# Altium project DuAn_HMI_F7.PrjPcb
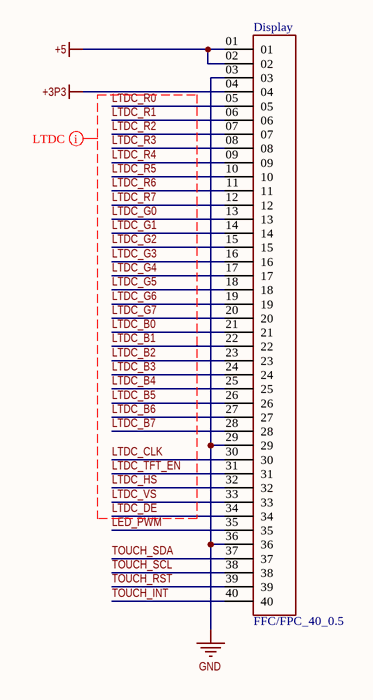
[diagram p0: LCD_TFT_Module.SchDoc]
6 sheets, 107 parts. Net scope: global (net labels, ports and power ports of the same name join across sheets).
Board file: HMI_F7_V3.PcbDoc
Sheets:
  LCD_TFT_Module.SchDoc
  LCD_TFT.SchDoc
  SDRAM.SchDoc
  RS232.SchDoc
  MCU.SchDoc
  POWERDoc.SchDoc

## Sheet LCD_TFT_Module.SchDoc
size A; SheetNumber: 1; SheetTotal: 6

### Parts
Display  FFC/FPC_40_0.5  [FFC_40_0.5mm]

### Nets
+3P3: Display.04
+5: Display.01 Display.02
GND: Display.03 Display.29 Display.36
LED_PWM: Display.35
LTDC_B0: Display.21
LTDC_B1: Display.22
LTDC_B2: Display.23
LTDC_B3: Display.24
LTDC_B4: Display.25
LTDC_B5: Display.26
LTDC_B6: Display.27
LTDC_B7: Display.28
LTDC_CLK: Display.30
LTDC_DE: Display.34
LTDC_G0: Display.13
LTDC_G1: Display.14
LTDC_G2: Display.15
LTDC_G3: Display.16
LTDC_G4: Display.17
LTDC_G5: Display.18
LTDC_G6: Display.19
LTDC_G7: Display.20
LTDC_HS: Display.32
LTDC_R0: Display.05
LTDC_R1: Display.06
LTDC_R2: Display.07
LTDC_R3: Display.08
LTDC_R4: Display.09
LTDC_R5: Display.10
LTDC_R6: Display.11
LTDC_R7: Display.12
LTDC_TFT_EN: Display.31
LTDC_VS: Display.33
TOUCH_INT: Display.40
TOUCH_RST: Display.39
TOUCH_SCL: Display.38
TOUCH_SDA: Display.37

### Layout directives
net class LTDC: LTDC_B0, LTDC_B1, LTDC_B2, LTDC_B3, LTDC_B4, LTDC_B5, LTDC_B6, LTDC_B7, LTDC_CLK, LTDC_DE, LTDC_G0, LTDC_G1, LTDC_G2, LTDC_G3, LTDC_G4, LTDC_G5, LTDC_G6, LTDC_G7, LTDC_HS, LTDC_R0, LTDC_R1, LTDC_R2, LTDC_R3, LTDC_R4, LTDC_R5, LTDC_R6, LTDC_R7, LTDC_TFT_EN, LTDC_VS

### Library data of the parts
Display = FFC/FPC_40_0.5: MF: Samtec; MP: ZF5S-40-02-T-WT; Package: None; Availability: Unavailable; Value: *; Price: None

## Sheet LCD_TFT.SchDoc
size A; SheetNumber: 2; SheetTotal: 5
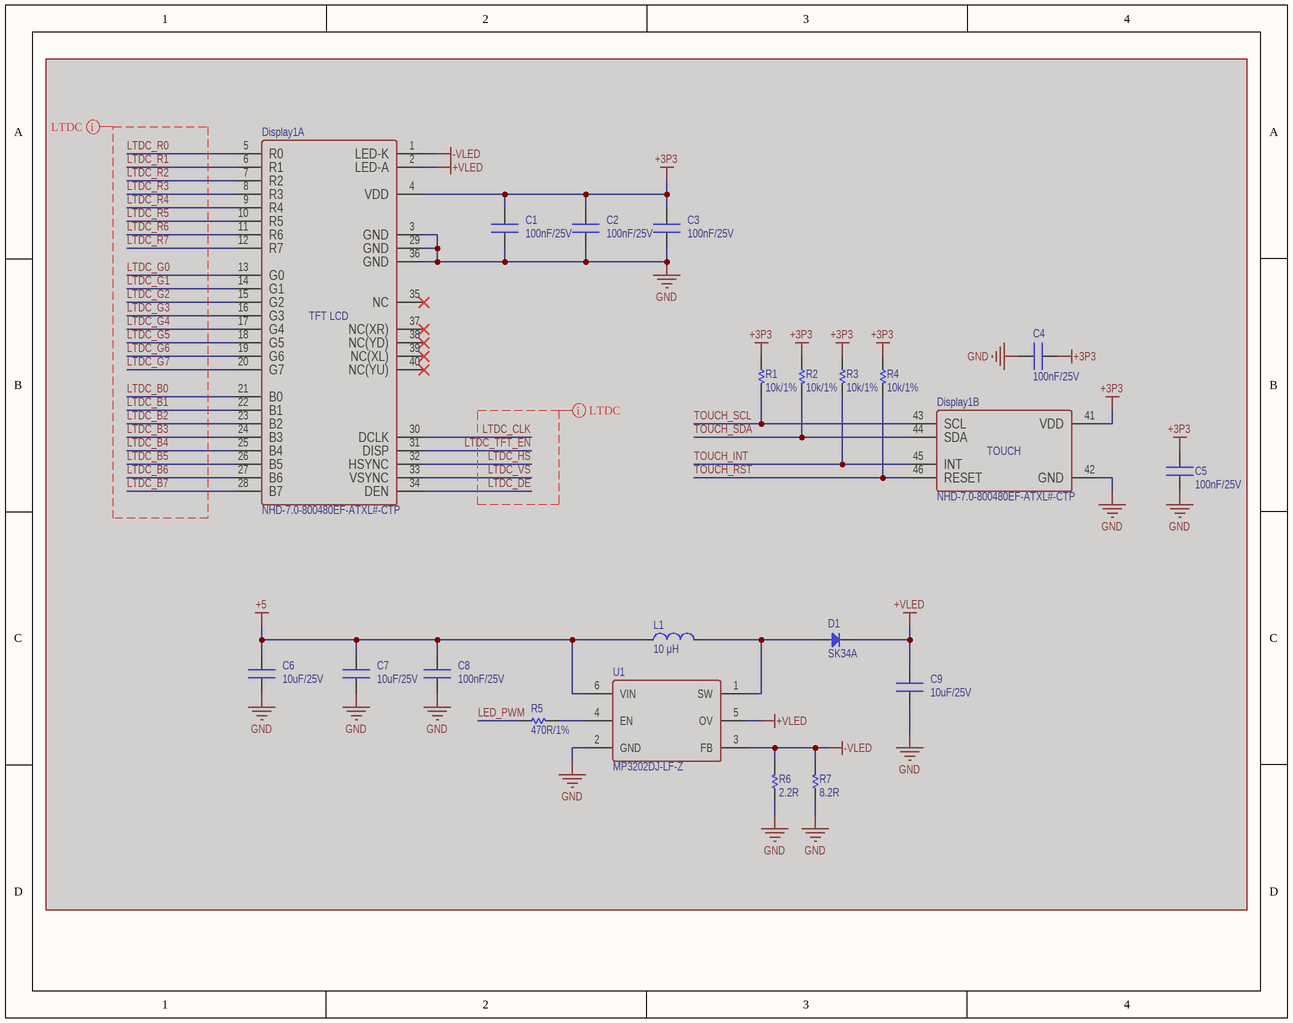
[diagram p1: LCD_TFT.SchDoc]

### Parts
C1  100nF/25V  [CN-SMD-0603]  (masked out: inside a compile mask, not in the netlist)
C2  100nF/25V  [CN-SMD-0603]  (masked out: inside a compile mask, not in the netlist)
C3  100nF/25V  [CN-SMD-0603]  (masked out: inside a compile mask, not in the netlist)
C4  100nF/25V  [CN-SMD-0603]  (masked out: inside a compile mask, not in the netlist)
C5  100nF/25V  [CN-SMD-0603]  (masked out: inside a compile mask, not in the netlist)
C6  10uF/25V  [CN-SMD-0603]  (masked out: inside a compile mask, not in the netlist)
C7  10uF/25V  [CN-SMD-0603]  (masked out: inside a compile mask, not in the netlist)
C8  100nF/25V  [CN-SMD-0603]  (masked out: inside a compile mask, not in the netlist)
C9  10uF/25V  [CN-SMD-0603]  (masked out: inside a compile mask, not in the netlist)
D1  SK34A  [DIO-SMD-A]  (masked out: inside a compile mask, not in the netlist)
Display1  NHD-7.0-800480EF-ATXL#-CTP  [NHD-7.0-800480EF-ATXL#-CTP]  (parts A,B of 2)  (masked out: inside a compile mask, not in the netlist)
L1  10 μH  [L-SMD-M-5x5]  (masked out: inside a compile mask, not in the netlist)
R1  10k/1%  [RES-SMD-0603]  (masked out: inside a compile mask, not in the netlist)
R2  10k/1%  [RES-SMD-0603]  (masked out: inside a compile mask, not in the netlist)
R3  10k/1%  [RES-SMD-0603]  (masked out: inside a compile mask, not in the netlist)
R4  10k/1%  [RES-SMD-0603]  (masked out: inside a compile mask, not in the netlist)
R5  470R/1%  [RES-SMD-0603]  (masked out: inside a compile mask, not in the netlist)
R6  2.2R  [RES-SMD-0805]  (masked out: inside a compile mask, not in the netlist)
R7  8.2R  [RES-SMD-0805]  (masked out: inside a compile mask, not in the netlist)
U1  MP3202DJ-LF-Z  [SOT23-6]  (masked out: inside a compile mask, not in the netlist)

### Layout directives
net class LTDC: LTDC_B0, LTDC_B1, LTDC_B2, LTDC_B3, LTDC_B4, LTDC_B5, LTDC_B6, LTDC_B7, LTDC_CLK, LTDC_DE, LTDC_G0, LTDC_G1, LTDC_G2, LTDC_G3, LTDC_G4, LTDC_G5, LTDC_G6, LTDC_G7, LTDC_HS, LTDC_R0, LTDC_R1, LTDC_R2, LTDC_R3, LTDC_R4, LTDC_R5, LTDC_R6, LTDC_R7, LTDC_TFT_EN, LTDC_VS

### Notes on the sheet
- (in symbol NHD-7.0-800480EF-ATXL#-CTP, part A) TFT LCD
- (in symbol NHD-7.0-800480EF-ATXL#-CTP, part B) TOUCH

### Library data of the parts
C1-C5 C8 = CN: CAP CER 0.1UF 25V X7R 0603; PN: CL10B104KA8NNNC
  C1: ComponentLink1Description: PN; ComponentLink1URL: CL10B104KA8NNNC
C6 C7 C9 = CN: CAP CER 10UF 25V X5R 0603; PN: CL10A106MA8NRNC
D1 = Diode SMD: DIODE SCHOTTKY 40V 3A DO214AC; Code - JEDEC: DO-214-AB; Published: 8-Jun-2000; Revision: July-2002: Re-released for DXP Platform.; Publisher: Altium Limited; PN: SK34A
Display1 = NHD-7.0-800480EF-ATXL#-CTP: TFT (Thin-Film-Transistor) Color Liquid Crystal Display Module, 0541044031 + 52271-0679; PN: NHD-7.0-800480EF-ATXL#-CTP
L1 = L-SMD-1: FIXED IND 10UH 1.2A 125 MOHM SMD; Manufacturer: Wurth Elektronik; PN: NRS5024T100MMGJ; Inductance: 10 μH; ComponentLink1Description: Manufacturer; ComponentLink1URL: http://www.we-online.de; Created by: Baojun Chen; Created Date: Nov.2015; ComponentLink2Description: Datasheet; ComponentLink2URL: http://katalog.we-online.de/pbs/datasheet/78477010.pdf
R1-R4 = Res-SMD: RES SMD 10K OHM 1% 1/10W 0603; Manufacturer: Generic Components; Class: Passive; PN: ERJ-3EKF1002V; Published: 08/06/2000; Publisher: Altium Hobart Technology Centre
R5 = Res-SMD: RES 470 OHM 1% 1/10W 0603; Manufacturer: Generic Components; PN: RC0603FR-07470RL; Published: 08/06/2000; Publisher: Altium Hobart Technology Centre
R6 = Res-SMD: RES 2.2 OHM 5% 1/8W 0805; Manufacturer: Generic Components; PN: RMCF0805JT2R20; Class: Passive; Publisher: Altium Hobart Technology Centre
R7 = Res-SMD: RES 8.2 OHM 1% 1/8W 0805; Manufacturer: Generic Components; PN: RMCF0805FT8R20; Class: Passive; Publisher: Altium Hobart Technology Centre
U1 = MP3202: IC LED DRVR RGLTR PWM TSOT23-6; PN: MP3202DJ-LF-Z

## Sheet SDRAM.SchDoc
size A; SheetNumber: 2; SheetTotal: 5
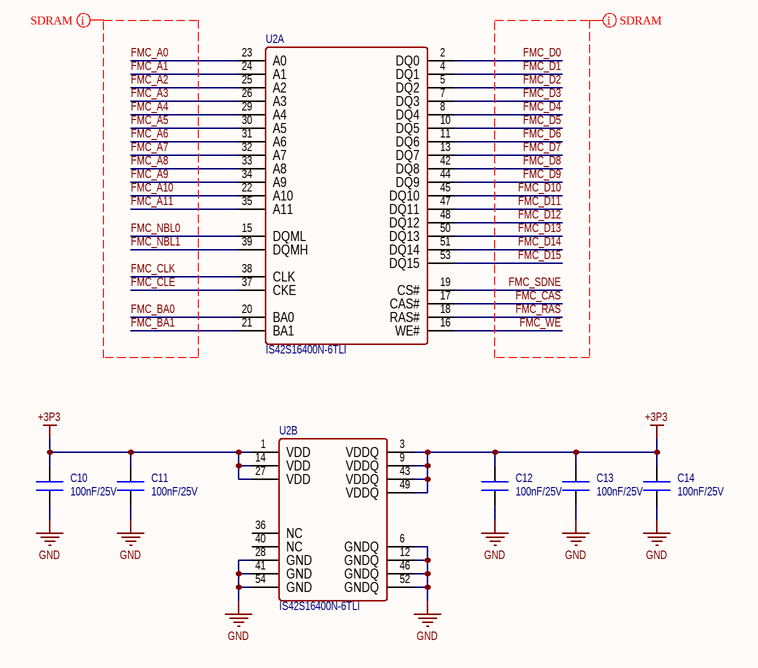
[diagram p2: SDRAM.SchDoc]

### Parts
C10  100nF/25V  [CN-SMD-0603]
C11  100nF/25V  [CN-SMD-0603]
C12  100nF/25V  [CN-SMD-0603]
C13  100nF/25V  [CN-SMD-0603]
C14  100nF/25V  [CN-SMD-0603]
U2  IS42S16400N-6TLI  [TSOP80P1180X100-54N]  (parts A,B of 2)

### Nets
+3P3: C10.2 C11.2 C12.2 C13.2 C14.2 U2.1(VDD) U2.3(VDDQ) U2.9(VDDQ) U2.14(VDD) U2.27(VDD) U2.43(VDDQ) U2.49(VDDQ)
GND: C10.1 C11.1 C12.1 C13.1 C14.1 U2.6(GNDQ) U2.12(GNDQ) U2.28(GND) U2.41(GND) U2.46(GNDQ) U2.52(GNDQ) U2.54(GND)
FMC_A0: U2.23(A0)
FMC_A1: U2.24(A1)
FMC_A2: U2.25(A2)
FMC_A3: U2.26(A3)
FMC_A4: U2.29(A4)
FMC_A5: U2.30(A5)
FMC_A6: U2.31(A6)
FMC_A7: U2.32(A7)
FMC_A8: U2.33(A8)
FMC_A9: U2.34(A9)
FMC_A10: U2.22(A10)
FMC_A11: U2.35(A11)
FMC_BA0: U2.20(BA0)
FMC_BA1: U2.21(BA1)
FMC_CAS: U2.17(CAS#)
FMC_CLE: U2.37(CKE)
FMC_CLK: U2.38(CLK)
FMC_D0: U2.2(DQ0)
FMC_D1: U2.4(DQ1)
FMC_D2: U2.5(DQ2)
FMC_D3: U2.7(DQ3)
FMC_D4: U2.8(DQ4)
FMC_D5: U2.10(DQ5)
FMC_D6: U2.11(DQ6)
FMC_D7: U2.13(DQ7)
FMC_D8: U2.42(DQ8)
FMC_D9: U2.44(DQ9)
FMC_D10: U2.45(DQ10)
FMC_D11: U2.47(DQ11)
FMC_D12: U2.48(DQ12)
FMC_D13: U2.50(DQ13)
FMC_D14: U2.51(DQ14)
FMC_D15: U2.53(DQ15)
FMC_NBL0: U2.15(DQML)
FMC_NBL1: U2.39(DQMH)
FMC_RAS: U2.18(RAS#)
FMC_SDNE: U2.19(CS#)
FMC_WE: U2.16(WE#)

Not connected (* = marked no-connect by the designer): U2 36(NC) 40(NC)

### Layout directives
net class SDRAM: FMC_A0, FMC_A1, FMC_A2, FMC_A3, FMC_A4, FMC_A5, FMC_A6, FMC_A7, FMC_A8, FMC_A9, FMC_A10, FMC_A11, FMC_BA0, FMC_BA1, FMC_CAS, FMC_CLE, FMC_CLK, FMC_D0, FMC_D1, FMC_D2, FMC_D3, FMC_D4, FMC_D5, FMC_D6, FMC_D7, FMC_D8, FMC_D9, FMC_D10, FMC_D11, FMC_D12, FMC_D13, FMC_D14, FMC_D15, FMC_NBL0, FMC_NBL1, FMC_RAS, FMC_SDNE, FMC_WE

### Library data of the parts
C10-C14 = CN: as C1 on sheet LCD_TFT
U2 = IS42S16400N-6TLI: 1 Meg Bits x 16 Bits x 4 Banks (64-MBIT) SYNCHRONOUS DYNAMIC RAM; PN: IS42S16400N-6TLI

## Sheet RS232.SchDoc
size A; SheetNumber: 3; SheetTotal: 5
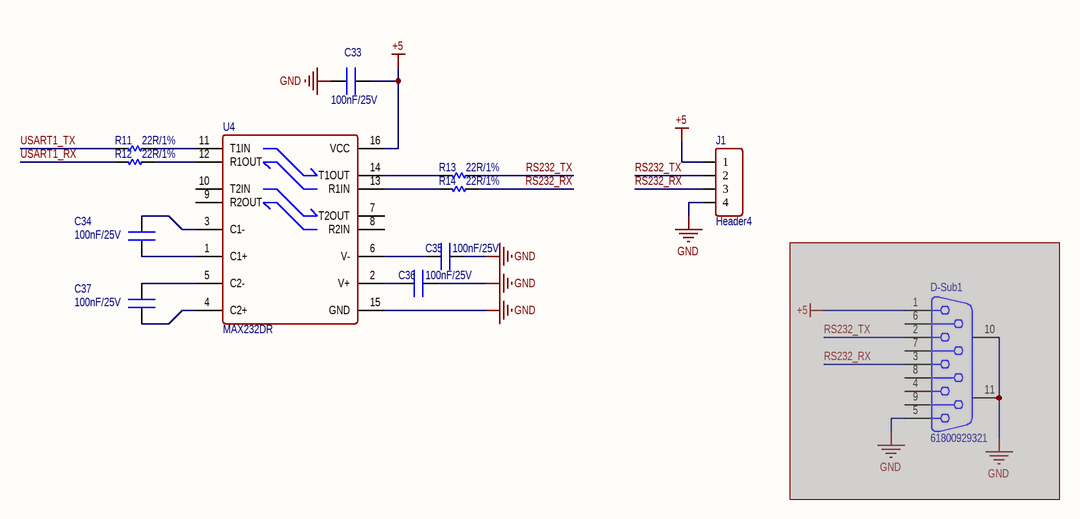
[diagram p3: RS232.SchDoc]

### Parts
C33  100nF/25V  [CN-SMD-0603]
C34  100nF/25V  [CN-SMD-0603]
C35  100nF/25V  [CN-SMD-0603]
C36  100nF/25V  [CN-SMD-0603]
C37  100nF/25V  [CN-SMD-0603]
D-Sub1  61800929321  [COM9SMDB]  (masked out: inside a compile mask, not in the netlist)
J1  Header4  [XH2.54-4-SMD]
R11  22R/1%  [RES-SMD-0603]
R12  22R/1%  [RES-SMD-0603]
R13  22R/1%  [RES-SMD-0603]
R14  22R/1%  [RES-SMD-0603]
U4  MAX232DR  [SO16]

### Nets
+5: C33.1 J1.1 U4.16(VCC)
GND: C33.2 C35.1 C36.1 J1.4 U4.15(GND)
RS232_RX: J1.3 R14.1
RS232_TX: J1.2 R13.1
USART1_RX: R12.2
USART1_TX: R11.2
NetC34_1: C34.1 U4.1(C1+)
NetC34_2: C34.2 U4.3(C1-)
NetC35_2: C35.2 U4.6(V-)
NetC36_2: C36.2 U4.2(V+)
NetC37_1: C37.1 U4.4(C2+)
NetC37_2: C37.2 U4.5(C2-)
NetR11_1: R11.1 U4.11(T1IN)
NetR12_1: R12.1 U4.12(R1OUT)
NetR13_2: R13.2 U4.14(T1OUT)
NetR14_2: R14.2 U4.13(R1IN)

Not connected (* = marked no-connect by the designer): U4 7(T2OUT) 8(R2IN) 9(R2OUT) 10(T2IN)

### Library data of the parts
C33-C37 = CN: as C1 on sheet LCD_TFT
D-Sub1 = CON 9BD: Manufacturer: Würth Elektronik eiSos GmbH; PN: 61800929321; ComponentLink1Description: Manufacturer; ComponentLink1URL: http://www.we-online.de; Created by: Christin Zierenner; Created Date: May 2012; ComponentLink2Description: Datasheet; ComponentLink2URL: http://katalog.we-online.de/kataloge/eisos/index.php?language=en&pf=Filter_gerade
J1 = Header4: Connector 4; Manufacturer: W¨¹rth Elektronik eiSos GmbH; partNo: 613002143121; ComponentLink1 Description: Manufacturer; ComponentLink2 Description: Datasheet; NoPins: 02; Created Date: 29 March 2013; ComponentLink1URL: http://www.we-online.com; ComponentLink2URL: http://katalog.we-online.de/em/datasheet/6130xx143121.pdf; Created by: Karrer Zheng
R11-R14 = Res-SMD: RES SMD 22 OHM 1% 1/10W 0603; PN: ERJ-3EKF22R0V
U4 = MAX3232: IC TRANSCEIVER FULL 2/2 16SOIC; PN: MAX232DR

## Sheet MCU.SchDoc
size C; SheetNumber: 5; SheetTotal: 6
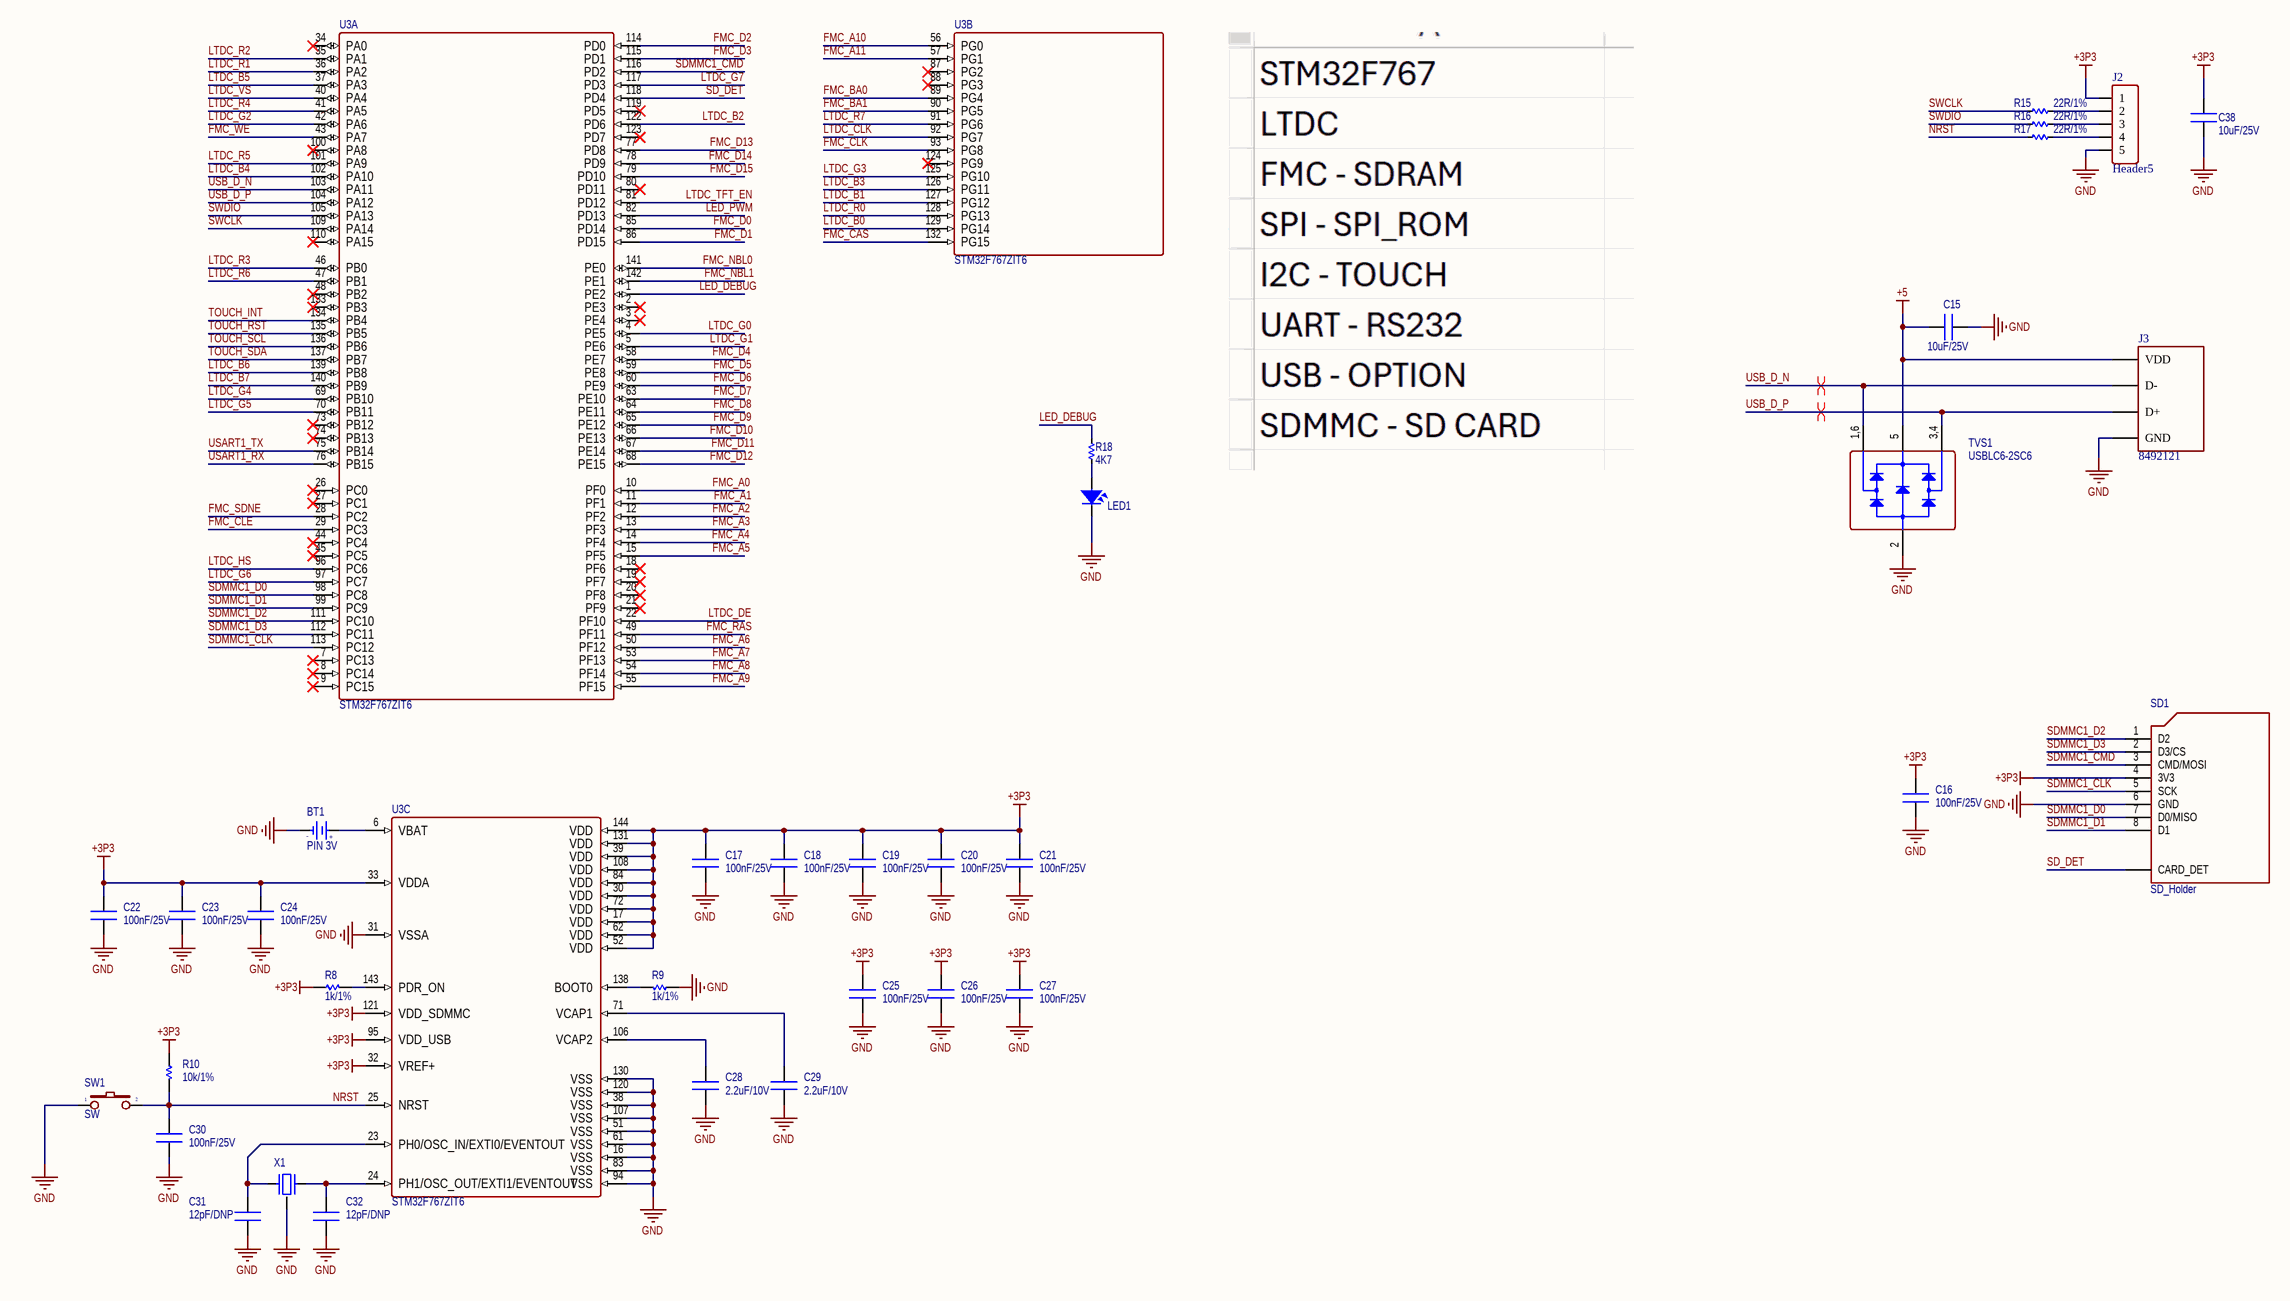
[diagram p4: MCU.SchDoc]

### Parts
BT1  PIN 3V  [BAT_3035]
C15  10uF/25V  [CN-SMD-0603]
C16  100nF/25V  [CN-SMD-0603]
C17  100nF/25V  [CN-SMD-0603]
C18  100nF/25V  [CN-SMD-0603]
C19  100nF/25V  [CN-SMD-0603]
C20  100nF/25V  [CN-SMD-0603]
C21  100nF/25V  [CN-SMD-0603]
C22  100nF/25V  [CN-SMD-0603]
C23  100nF/25V  [CN-SMD-0603]
C24  100nF/25V  [CN-SMD-0603]
C25  100nF/25V  [CN-SMD-0603]
C26  100nF/25V  [CN-SMD-0603]
C27  100nF/25V  [CN-SMD-0603]
C28  2.2uF/10V  [CN-SMD-0603]
C29  2.2uF/10V  [CN-SMD-0603]
C30  100nF/25V  [CN-SMD-0603]
C31  12pF/DNP  [CN-SMD-0603]
C32  12pF/DNP  [CN-SMD-0603]
C38  10uF/25V  [CN-SMD-0603]
J2  Header5  [XH2.54-5-SMD]
J3  8492121  [USB-C4]
LED1  LED  [LED-0603-RED]  (value not drawn)
R8  1k/1%  [RES-SMD-0603]
R9  1k/1%  [RES-SMD-0603]
R10  10k/1%  [RES-SMD-0603]
R15  22R/1%  [RES-SMD-0603]
R16  22R/1%  [RES-SMD-0603]
R17  22R/1%  [RES-SMD-0603]
R18  4K7  [RES-SMD-0603]
SD1  SD_Holder  [SD Socket]
SW1  SW  [SW1-SMD]
TVS1  USBLC6-2SC6  [SOT23-6]
U3  STM32F767ZIT6  [LQFP144]  (parts A,B,C of 3)
X1  XTAL 25MHz  [XT4-16.000MHz-4_V]  (value not drawn)

### Nets
+3P3: C16.2 C17.2 C18.2 C19.2 C20.2 C21.2 C22.2 C23.2 C24.2 C25.2 C26.2 C27.2 C38.1 J2.1 R8.2 R10.2 SD1.4(3V3) U3.17(VDD) U3.30(VDD) U3.32(VREF+) U3.33(VDDA) U3.39(VDD) U3.52(VDD) U3.62(VDD) U3.72(VDD) U3.84(VDD) U3.95(VDD_USB) U3.108(VDD) U3.121(VDD_SDMMC) U3.131(VDD) U3.144(VDD)
+5: C15.2 J3.1(VDD) TVS1.5
GND: BT1.2(GND) C15.1 C16.1 C17.1 C18.1 C19.1 C20.1 C21.1 C22.1 C23.1 C24.1 C25.1 C26.1 C27.1 C28.2 C29.2 C30.2 C31.1 C32.1 C38.2 J2.5 J3.4(GND) LED1.2 R9.2 SD1.6(GND) SW1.1 TVS1.2 U3.16(VSS) U3.31(VSSA) U3.38(VSS) U3.51(VSS) U3.61(VSS) U3.83(VSS) U3.94(VSS) U3.107(VSS) U3.120(VSS) U3.130(VSS) X1.2,4(GND)
FMC_A0: U3.10(PF0)
FMC_A1: U3.11(PF1)
FMC_A2: U3.12(PF2)
FMC_A3: U3.13(PF3)
FMC_A4: U3.14(PF4)
FMC_A5: U3.15(PF5)
FMC_A6: U3.50(PF12)
FMC_A7: U3.53(PF13)
FMC_A8: U3.54(PF14)
FMC_A9: U3.55(PF15)
FMC_A10: U3.56(PG0)
FMC_A11: U3.57(PG1)
FMC_BA0: U3.89(PG4)
FMC_BA1: U3.90(PG5)
FMC_CAS: U3.132(PG15)
FMC_CLE: U3.29(PC3)
FMC_CLK: U3.93(PG8)
FMC_D0: U3.85(PD14)
FMC_D1: U3.86(PD15)
FMC_D2: U3.114(PD0)
FMC_D3: U3.115(PD1)
FMC_D4: U3.58(PE7)
FMC_D5: U3.59(PE8)
FMC_D6: U3.60(PE9)
FMC_D7: U3.63(PE10)
FMC_D8: U3.64(PE11)
FMC_D9: U3.65(PE12)
FMC_D10: U3.66(PE13)
FMC_D11: U3.67(PE14)
FMC_D12: U3.68(PE15)
FMC_D13: U3.77(PD8)
FMC_D14: U3.78(PD9)
FMC_D15: U3.79(PD10)
FMC_NBL0: U3.141(PE0)
FMC_NBL1: U3.142(PE1)
FMC_RAS: U3.49(PF11)
FMC_SDNE: U3.28(PC2)
FMC_WE: U3.43(PA7)
LED_DEBUG: R18.1 U3.1(PE2)
LED_PWM: U3.82(PD13)
LTDC_B0: U3.129(PG14)
LTDC_B1: U3.127(PG12)
LTDC_B2: U3.122(PD6)
LTDC_B3: U3.126(PG11)
LTDC_B4: U3.102(PA10)
LTDC_B5: U3.37(PA3)
LTDC_B6: U3.139(PB8)
LTDC_B7: U3.140(PB9)
LTDC_CLK: U3.92(PG7)
LTDC_DE: U3.22(PF10)
LTDC_G0: U3.4(PE5)
LTDC_G1: U3.5(PE6)
LTDC_G2: U3.42(PA6)
LTDC_G3: U3.125(PG10)
LTDC_G4: U3.69(PB10)
LTDC_G5: U3.70(PB11)
LTDC_G6: U3.97(PC7)
LTDC_G7: U3.117(PD3)
LTDC_HS: U3.96(PC6)
LTDC_R0: U3.128(PG13)
LTDC_R1: U3.36(PA2)
LTDC_R2: U3.35(PA1)
LTDC_R3: U3.46(PB0)
LTDC_R4: U3.41(PA5)
LTDC_R5: U3.101(PA9)
LTDC_R6: U3.47(PB1)
LTDC_R7: U3.91(PG6)
LTDC_TFT_EN: U3.81(PD12)
LTDC_VS: U3.40(PA4)
NRST: C30.1 R10.1 R17.2 SW1.2 U3.25(NRST)
SD_DET: SD1.9(CARD_DET) U3.118(PD4)
SDMMC1_CLK: SD1.5(SCK) U3.113(PC12)
SDMMC1_CMD: SD1.3(CMD/MOSI) U3.116(PD2)
SDMMC1_D0: SD1.7(D0/MISO) U3.98(PC8)
SDMMC1_D1: SD1.8(D1) U3.99(PC9)
SDMMC1_D2: SD1.1(D2) U3.111(PC10)
SDMMC1_D3: SD1.2(D3/CS) U3.112(PC11)
SWCLK: R15.2 U3.109(PA14)
SWDIO: R16.2 U3.105(PA13)
TOUCH_INT: U3.134(PB4)
TOUCH_RST: U3.135(PB5)
TOUCH_SCL: U3.136(PB6)
TOUCH_SDA: U3.137(PB7)
USART1_RX: U3.76(PB15)
USART1_TX: U3.75(PB14)
USB_D_N: J3.2(D-) TVS1.1,6(IO1) U3.103(PA11)
USB_D_P: J3.3(D+) TVS1.3,4(IO2) U3.104(PA12)
NetBT1_1: BT1.1(+3V) U3.6(VBAT)
NetC28_1: C28.1 U3.106(VCAP2)
NetC29_1: C29.1 U3.71(VCAP1)
NetC31_2: C31.2 U3.23(PH0/OSC_IN/EXTI0/EVENTOUT) X1.1
NetC32_2: C32.2 U3.24(PH1/OSC_OUT/EXTI1/EVENTOUT) X1.3
NetJ2_2: J2.2 R15.1
NetJ2_3: J2.3 R16.1
NetJ2_4: J2.4 R17.1
NetLED1_1: LED1.1 R18.2
NetR8_1: R8.1 U3.143(PDR_ON)
NetR9_1: R9.1 U3.138(BOOT0)

Not connected (* = marked no-connect by the designer): U3 2(PE3)* 3(PE4)* 7(PC13)* 8(PC14)* 9(PC15)* 18(PF6)* 19(PF7)* 20(PF8)* 21(PF9)* 26(PC0)* 27(PC1)* 34(PA0)* 44(PC4)* 45(PC5)* 48(PB2)* 73(PB12)* 74(PB13)* 80(PD11)* 87(PG2)* 88(PG3)* 100(PA8)* 110(PA15)* 119(PD5)* 123(PD7)* 124(PG9)* 133(PB3)*

### Layout directives
differential pair: USB_D_N, USB_D_P

### Notes on the sheet
- (in symbol PIN 3V) -; +

### Library data of the parts
BT1 = PIN 3V: Battery 3VDC; Value: PIN 3V
C15 C38 = CN: as C6 on sheet LCD_TFT
C16-C27 C30 = CN: as C1 on sheet LCD_TFT
C28 C29 = CN: CAP CER 2.2UF 10V X7R 0603; PN: CL10B225KP8NNNC
C31 C32 = CN: CAP CER 12PF 50V C0G/NP0 0603; PN: CL10C120JB81PNC
J2 = Header5: Connector 5; Manufacturer: W¨¹rth Elektronik eiSos GmbH; partNo: 613002143121; ComponentLink1 Description: Manufacturer; ComponentLink2 Description: Datasheet; NoPins: 02; Created Date: 29 March 2013; ComponentLink1URL: http://www.we-online.com; ComponentLink2URL: http://katalog.we-online.de/em/datasheet/6130xx143121.pdf; Created by: Karrer Zheng
J3 = USB-4: THT USB 2.0 A Connector WE-EPLE; Manufacturer: Würth Elektronik eiSos GmbH; PartNo: 8492121; ComponentLink1Description: Manufacturer; ComponentLink1URL: http://www.we-online.de; Created by: Christin Otto; Created Date: OCT-2014; ComponentLink2Description: Datasheet; ComponentLink2URL: http://www.we-online.de/katalog/media/pdf/8492121.pdf
LED1 = LED SMD: LED RED CLEAR 0603 SMD; PN: 150060RS75000
R8 R9 = Res-SMD: RES SMD 1K OHM 1% 1/10W 0603; Manufacturer: Generic Components; PN: ERJ-3EKF1001V; Class: Passive; Publisher: Altium Hobart Technology Centre
R10 = Res-SMD: RES SMD 10K OHM 1% 1/10W 0603; Manufacturer: Generic Components; PN: ERJ-3EKF1002V; Class: Passive; Publisher: Altium Hobart Technology Centre
R15-R17 = Res-SMD: RES SMD 22 OHM 1% 1/10W 0603; Manufacturer: Generic Components; PN: ERJ-3EKF22R0V; Published: 08/06/2000; Publisher: Altium Hobart Technology Centre
R18 = Res-SMD: RES SMD 4.7K OHM 1% 1/10W 0603; Manufacturer: Generic Components; PN: ERJ-3EKF4701V; Published: 08/06/2000; Publisher: Altium Hobart Technology Centre
SW1 = SW2: Switch button 2 pin; Value: SW chip 2 pin
TVS1 = USBLC6-2: TVS DIODE 5.25VWM 17VC SOT23-6; PN: USBLC6-2SC6
U3 = STM32F767ZIT6: High-performance MCU based on Cortex-M7 core with DSP and double-precision FPU, up to 216 MHz CPU, up to 2 MB Flash, ART Accelerator and L1 cache for zero-wait execution.; PN: STM32F767ZIT6
X1 = XT4: CRYSTAL 25.0000MHZ 18PF SMD; PN: TSX-3225 25.0000MF10P-C0

## Sheet POWERDoc.SchDoc
size A; SheetNumber: 6; SheetTotal: 6
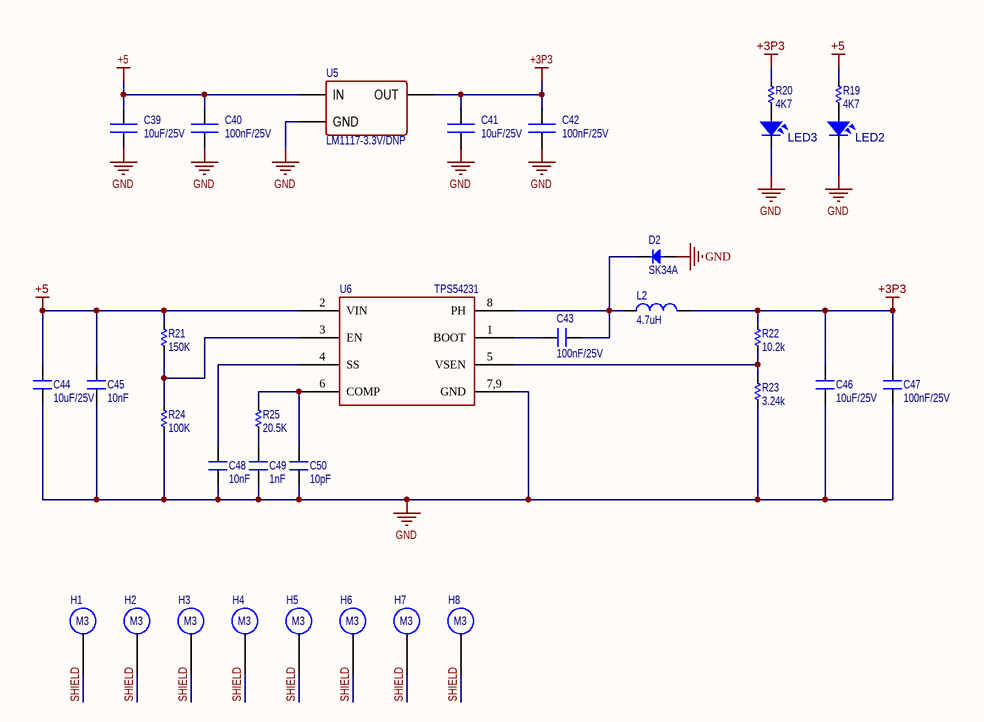
[diagram p5: POWERDoc.SchDoc]

### Parts
C39  10uF/25V  [CN-SMD-0603]
C40  100nF/25V  [CN-SMD-0603]
C41  10uF/25V  [CN-SMD-0603]
C42  100nF/25V  [CN-SMD-0603]
C43  100nF/25V  [CN-SMD-0603]
C44  10uF/25V  [CN-SMD-0603]
C45  10nF  [CN-SMD-0603]
C46  10uF/25V  [CN-SMD-0603]
C47  100nF/25V  [CN-SMD-0603]
C48  10nF  [CN-SMD-0603]
C49  1nF  [CN-SMD-0603]
C50  10pF  [CN-SMD-0603]
D2  SK34A  [DIO-SMD-A]
H1  M3  [M3]  (no BOM)
H2  M3  [M3]  (no BOM)
H3  M3  [M3]  (no BOM)
H4  M3  [M3]  (no BOM)
H5  M3  [M3]  (no BOM)
H6  M3  [M3]  (no BOM)
H7  M3  [M3]  (no BOM)
H8  M3  [M3]  (no BOM)
L2  4.7uH  [IND_AMDLA4020S-2R2MT]
LED2  LED  [LED-0603-RED]  (value not drawn)
LED3  LED  [LED-0603-RED]  (value not drawn)
R19  4K7  [RES-SMD-0603]
R20  4K7  [RES-SMD-0603]
R21  150K  [RES-SMD-0603]
R22  10.2k  [RES-SMD-0603]
R23  3.24k  [RES-SMD-0603]
R24  100K  [RES-SMD-0603]
R25  20.5K  [RES-SMD-0603]
U5  LM1117-3.3V/DNP  [SOT223]
U6  TPS54231  [HSOP8]

### Nets
+3P3: C41.2 C42.2 C46.2 C47.2 L2.2 R20.1 R22.1 U5.2,4(OUT)
+5: C39.2 C40.2 C44.2 C45.2 R19.1 R21.1 U5.3(IN) U6.2(VIN)
GND: C39.1 C40.1 C41.1 C42.1 C44.1 C45.1 C46.1 C47.1 C48.1 C49.1 C50.1 D2.1(A) LED2.2 LED3.2 R23.2 R24.2 U5.1(GND) U6.7,9(GND)
SHIELD: H1.1 H2.1 H3.1 H4.1 H5.1 H6.1 H7.1 H8.1
NetC43_1: C43.1 D2.2(K) L2.1 U6.8(PH)
NetC43_2: C43.2 U6.1(BOOT)
NetC48_2: C48.2 U6.4(SS)
NetC49_2: C49.2 R25.2
NetC50_2: C50.2 R25.1 U6.6(COMP)
NetLED2_1: LED2.1 R19.2
NetLED3_1: LED3.1 R20.2
NetR21_2: R21.2 R24.1 U6.3(EN)
NetR22_2: R22.2 R23.1 U6.5(VSEN)

### Library data of the parts
C39 C41 C44 C46 = CN: as C6 on sheet LCD_TFT
C40 C42 C43 C47 = CN: as C1 on sheet LCD_TFT
C45 C48 = CN: CAP CER 10000PF 50V X7R 0603; PN: CL10B103KB8NNNC
C49 = CN: CAP CER 0603 1NF 10V ULTRA STABL; PN: C0603C102J8HACAUTO
C50 = CN: CAP CER 10PF 50V C0G/NP0 0603; PN: C0603C100J5GACTU
D2 = Diode SMD: as D1 on sheet LCD_TFT; Published: 8-Jun-2000; Revision: July-2002: Re-released for DXP Platform.; Publisher: Altium Limited; PN: SK34A
L2 = L-SMD-1: FIXED IND 4.7UH 3A 70 MOHM SMD; Manufacturer: Wurth Elektronik; PN: AMDLA4020S-4R7MT; Inductance: 1.0 μH; ComponentLink1Description: Manufacturer; ComponentLink1URL: http://www.we-online.de; Created by: Baojun Chen; Created Date: Nov.2015; ComponentLink2Description: Datasheet; ComponentLink2URL: http://katalog.we-online.de/pbs/datasheet/78477010.pdf
LED2 LED3 = LED SMD: as LED1 on sheet MCU
R19 R20 = Res-SMD: as R18 on sheet MCU; Published: 08/06/2000; Publisher: Altium Hobart Technology Centre
R21 = Res-SMD: RES 150K OHM 1% 1/10W 0603; Manufacturer: Generic Components; PN: RMCF0603FT150K; Published: 08/06/2000; Publisher: Altium Hobart Technology Centre
R22 = Res-SMD: RES 10.2K OHM 1% 1/10W 0603; Manufacturer: Generic Components; PN: RC0603FR-0710K2L; Published: 08/06/2000; Publisher: Altium Hobart Technology Centre
R23 = Res-SMD: RES 3.24K OHM 1% 1/10W 0603; Manufacturer: Generic Components; PN: RMCF0603FT3K24; Published: 08/06/2000; Publisher: Altium Hobart Technology Centre
R24 = Res-SMD: RES 100K OHM 1% 1/10W 0603; Manufacturer: Generic Components; PN: RC0603FR-07100KL; Published: 08/06/2000; Publisher: Altium Hobart Technology Centre
R25 = Res-SMD: RES 20.5K OHM 1% 1/10W 0603; Manufacturer: Generic Components; PN: RC0603FR-0720K5L; Published: 08/06/2000; Publisher: Altium Hobart Technology Centre
U5 = LM1117: IC REG LIN 3.3V 800MA SOT-223-4; PN: TLV1117-33IDCYR; Website: http://group3i.net
U6 = TPS54231DR: TPS54231 2-A, 28-V Input, Step-Down DC-DC Converter With Eco-mode; PN: TPS54231DR

## Nets that join several sheets
+3P3: LCD_TFT_Module (Display.04), SDRAM (12 pins), MCU (31 pins), POWERDoc (8 pins)
+5: LCD_TFT_Module (Display.01 Display.02), RS232 (C33.1 J1.1 U4.16), MCU (C15.2 J3.1 TVS1.5), POWERDoc (8 pins)
GND: LCD_TFT_Module (Display.03 Display.29 Display.36), SDRAM (12 pins), RS232 (5 pins), MCU (38 pins), POWERDoc (18 pins)
FMC_A0: SDRAM (U2.23), MCU (U3.10)
FMC_A1: SDRAM (U2.24), MCU (U3.11)
FMC_A2: SDRAM (U2.25), MCU (U3.12)
FMC_A3: SDRAM (U2.26), MCU (U3.13)
FMC_A4: SDRAM (U2.29), MCU (U3.14)
FMC_A5: SDRAM (U2.30), MCU (U3.15)
FMC_A6: SDRAM (U2.31), MCU (U3.50)
FMC_A7: SDRAM (U2.32), MCU (U3.53)
FMC_A8: SDRAM (U2.33), MCU (U3.54)
FMC_A9: SDRAM (U2.34), MCU (U3.55)
FMC_A10: SDRAM (U2.22), MCU (U3.56)
FMC_A11: SDRAM (U2.35), MCU (U3.57)
FMC_BA0: SDRAM (U2.20), MCU (U3.89)
FMC_BA1: SDRAM (U2.21), MCU (U3.90)
FMC_CAS: SDRAM (U2.17), MCU (U3.132)
FMC_CLE: SDRAM (U2.37), MCU (U3.29)
FMC_CLK: SDRAM (U2.38), MCU (U3.93)
FMC_D0: SDRAM (U2.2), MCU (U3.85)
FMC_D1: SDRAM (U2.4), MCU (U3.86)
FMC_D2: SDRAM (U2.5), MCU (U3.114)
FMC_D3: SDRAM (U2.7), MCU (U3.115)
FMC_D4: SDRAM (U2.8), MCU (U3.58)
FMC_D5: SDRAM (U2.10), MCU (U3.59)
FMC_D6: SDRAM (U2.11), MCU (U3.60)
FMC_D7: SDRAM (U2.13), MCU (U3.63)
FMC_D8: SDRAM (U2.42), MCU (U3.64)
FMC_D9: SDRAM (U2.44), MCU (U3.65)
FMC_D10: SDRAM (U2.45), MCU (U3.66)
FMC_D11: SDRAM (U2.47), MCU (U3.67)
FMC_D12: SDRAM (U2.48), MCU (U3.68)
FMC_D13: SDRAM (U2.50), MCU (U3.77)
FMC_D14: SDRAM (U2.51), MCU (U3.78)
FMC_D15: SDRAM (U2.53), MCU (U3.79)
FMC_NBL0: SDRAM (U2.15), MCU (U3.141)
FMC_NBL1: SDRAM (U2.39), MCU (U3.142)
FMC_RAS: SDRAM (U2.18), MCU (U3.49)
FMC_SDNE: SDRAM (U2.19), MCU (U3.28)
FMC_WE: SDRAM (U2.16), MCU (U3.43)
LED_PWM: LCD_TFT_Module (Display.35), MCU (U3.82)
LTDC_B0: LCD_TFT_Module (Display.21), MCU (U3.129)
LTDC_B1: LCD_TFT_Module (Display.22), MCU (U3.127)
LTDC_B2: LCD_TFT_Module (Display.23), MCU (U3.122)
LTDC_B3: LCD_TFT_Module (Display.24), MCU (U3.126)
LTDC_B4: LCD_TFT_Module (Display.25), MCU (U3.102)
LTDC_B5: LCD_TFT_Module (Display.26), MCU (U3.37)
LTDC_B6: LCD_TFT_Module (Display.27), MCU (U3.139)
LTDC_B7: LCD_TFT_Module (Display.28), MCU (U3.140)
LTDC_CLK: LCD_TFT_Module (Display.30), MCU (U3.92)
LTDC_DE: LCD_TFT_Module (Display.34), MCU (U3.22)
LTDC_G0: LCD_TFT_Module (Display.13), MCU (U3.4)
LTDC_G1: LCD_TFT_Module (Display.14), MCU (U3.5)
LTDC_G2: LCD_TFT_Module (Display.15), MCU (U3.42)
LTDC_G3: LCD_TFT_Module (Display.16), MCU (U3.125)
LTDC_G4: LCD_TFT_Module (Display.17), MCU (U3.69)
LTDC_G5: LCD_TFT_Module (Display.18), MCU (U3.70)
LTDC_G6: LCD_TFT_Module (Display.19), MCU (U3.97)
LTDC_G7: LCD_TFT_Module (Display.20), MCU (U3.117)
LTDC_HS: LCD_TFT_Module (Display.32), MCU (U3.96)
LTDC_R0: LCD_TFT_Module (Display.05), MCU (U3.128)
LTDC_R1: LCD_TFT_Module (Display.06), MCU (U3.36)
LTDC_R2: LCD_TFT_Module (Display.07), MCU (U3.35)
LTDC_R3: LCD_TFT_Module (Display.08), MCU (U3.46)
LTDC_R4: LCD_TFT_Module (Display.09), MCU (U3.41)
LTDC_R5: LCD_TFT_Module (Display.10), MCU (U3.101)
LTDC_R6: LCD_TFT_Module (Display.11), MCU (U3.47)
LTDC_R7: LCD_TFT_Module (Display.12), MCU (U3.91)
LTDC_TFT_EN: LCD_TFT_Module (Display.31), MCU (U3.81)
LTDC_VS: LCD_TFT_Module (Display.33), MCU (U3.40)
TOUCH_INT: LCD_TFT_Module (Display.40), MCU (U3.134)
TOUCH_RST: LCD_TFT_Module (Display.39), MCU (U3.135)
TOUCH_SCL: LCD_TFT_Module (Display.38), MCU (U3.136)
TOUCH_SDA: LCD_TFT_Module (Display.37), MCU (U3.137)
USART1_RX: RS232 (R12.2), MCU (U3.76)
USART1_TX: RS232 (R11.2), MCU (U3.75)